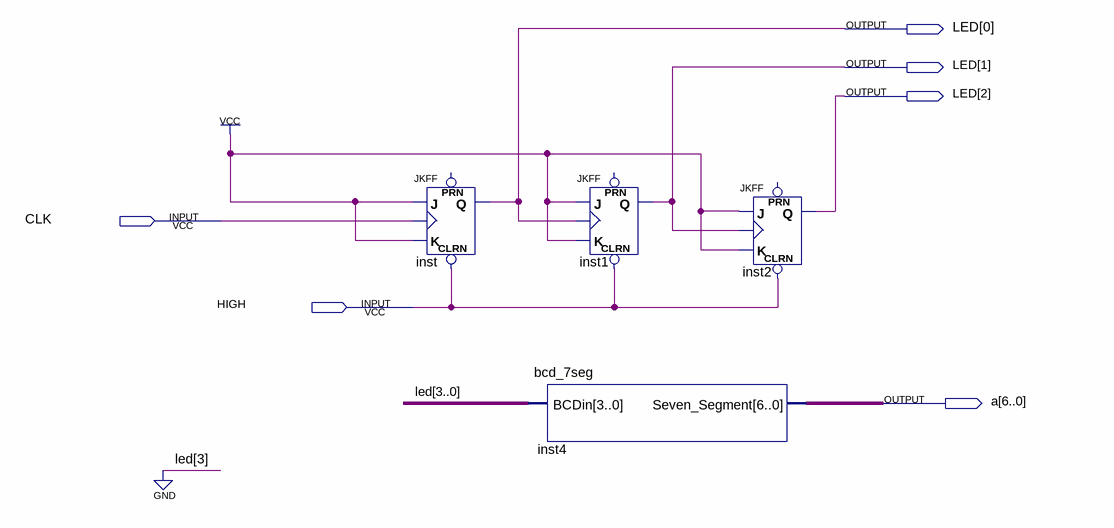
[diagram p0: schematic sheet]
// Quartus schematic COUNTER_3.bdf as structural Verilog: 4 symbols, 6 pins
module COUNTER_3 (
  input  CLK,
  input  HIGH,
  output [2:0] LED,
  output [6:0] a
);

  JKFF inst (.CLRN(HIGH), .K(1'b1), .J(1'b1), .CLK(CLK), .Q(LED[0]));  // open: PRN
  bcd_7seg inst4 (.BCDin({1'b0, LED}), .Seven_Segment(a));
  JKFF inst1 (.CLRN(HIGH), .K(1'b1), .J(1'b1), .CLK(LED[0]), .Q(LED[1]));  // open: PRN
  JKFF inst2 (.CLRN(HIGH), .K(1'b1), .J(1'b1), .CLK(LED[1]), .Q(LED[2]));  // open: PRN
endmodule
